# EAGLE design waterRunnerback (EAGLE 6.4)
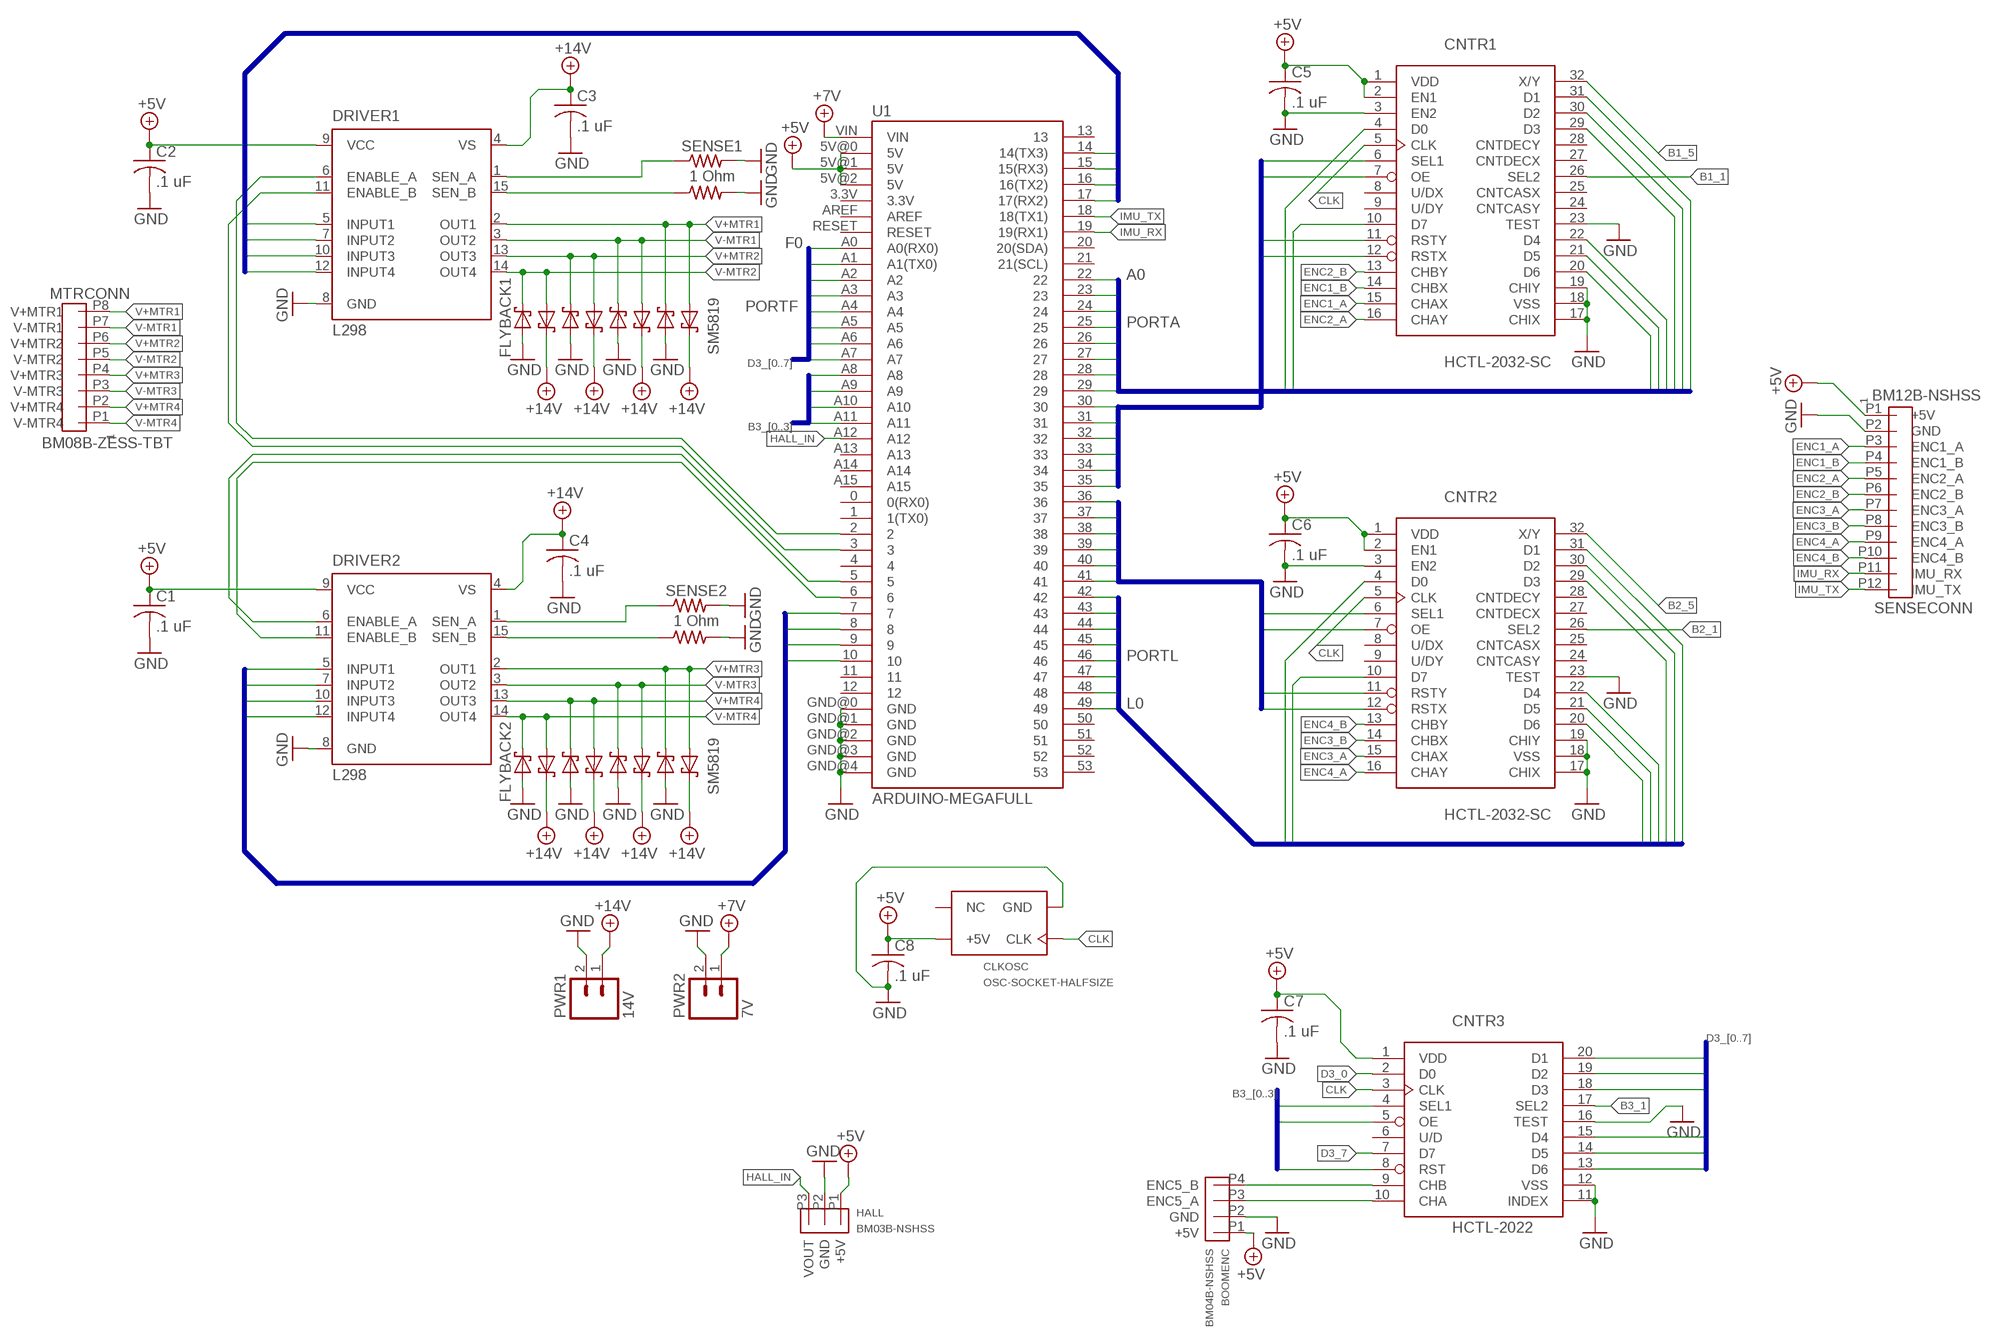
[diagram p0: schematic, sheet 1]

## Parts
BOOMENC  BM04B-NSHSS  [BM04B-NSHSS]
C1  .1 uF  C-USC1608  [C1608]
C2  .1 uF  C-USC1608  [C1608]
C3  .1 uF  C-USC1608  [C1608]
C4  .1 uF  C-USC1608  [C1608]
C5  .1 uF  C-USC1608  [C1608]
C6  .1 uF  C-USC1608  [C1608]
C7  .1 uF  C-USC1608  [C1608]
C8  .1 uF  C-USC1608  [C1608]
CLKOSC  OSC-SOCKET-HALFSIZE  [OSC-SOCKET-HALFSIZE]
CNTR1  HCTL-2032-SC  [SO32W]
CNTR2  HCTL-2032-SC  [SO32W]
CNTR3  HCTL-2022  [DIL20]
DRIVER1  L298  [MULTIWATT-15]
DRIVER2  L298  [MULTIWATT-15]
FLYBACK1  SM5819  SM5817  [SOD123FL]
FLYBACK2  SM5819  SM5817  [SOD123FL]
HALL  BM03B-NSHSS  [BM03B-NSHSS]
MTRCONN  BM08B-ZESS-TBT  [BM08B-ZESS-TBT]
PWR1  14V  M025MM  [SCREWTERMINAL-5MM-2]
PWR2  7V  M025MM  [SCREWTERMINAL-5MM-2]
R1  1 Ohm  RL1220  [RL1220]
R2  1 Ohm  RL1220  [RL1220]
SENSE1  1 Ohm  RL1220  [RL1220]
SENSE2  1 Ohm  RL1220  [RL1220]
SENSECONN  BM12B-NSHSS  [BM12B-NSHSS]
U1  ARDUINO-MEGAFULL  [ARDUINO_MEGA]
U$1  SM5817  [SOD123FL]
U$2  SM5817  [SOD123FL]
U$3  SM5819  SM5817  [SOD123FL]
U$4  SM5817  [SOD123FL]
U$5  SM5817  [SOD123FL]
U$6  SM5817  [SOD123FL]
U$7  SM5817  [SOD123FL]
U$8  SM5819  SM5817  [SOD123FL]
U$9  SM5817  [SOD123FL]
U$10  SM5817  [SOD123FL]
U$11  SM5817  [SOD123FL]
U$12  SM5817  [SOD123FL]
U$13  SM5817  [SOD123FL]
U$14  SM5819  SM5817  [SOD123FL]

## Nets
+5V: BOOMENC.P1(+5V) C1.1 C2.1 C5.1 C6.1 C7.1 C8.1 CLKOSC.P8(+5V) CNTR1.1(VDD) CNTR1.2(EN1) CNTR2.1(VDD) CNTR2.2(EN1) CNTR3.1(VDD) DRIVER1.9(VCC) DRIVER2.9(VCC) HALL.P1(+5V) SENSECONN.P1(+5V) U1.5V@0(5V) U1.5V@1(5V) U1.5V@2(5V)
+7V: PWR2.1 U1.VIN
+14V [PWR]: C3.1 C4.1 DRIVER1.4(VS) DRIVER2.4(VS) PWR1.1 U$1.C U$2.C U$4.C U$6.C U$8.C U$10.C U$12.C U$14.C
B1_0: CNTR1.6(SEL1) U1.30
B1_1: CNTR1.26(SEL2) U1.31
B1_2: CNTR1.7(OE) U1.32
B1_3: CNTR1.11(RSTY) U1.33
B1_4: CNTR1.12(RSTX) U1.34
B1_5: CNTR1.32(X/Y) U1.35
B2_0: CNTR2.6(SEL1) U1.36
B2_1: CNTR2.26(SEL2) U1.37
B2_2: CNTR2.7(OE) U1.38
B2_3: CNTR2.11(RSTY) U1.39
B2_4: CNTR2.12(RSTX) U1.40
B2_5: CNTR2.32(X/Y) U1.41
B3_0: CNTR3.4(SEL1) U1.A8
B3_1: CNTR3.17(SEL2) U1.A9
B3_2: CNTR3.5(OE) U1.A10
B3_3: CNTR3.8(RST) U1.A11
CLK: CLKOSC.P5(CLK) CNTR1.5(CLK) CNTR2.5(CLK) CNTR3.3(CLK)
D1_0: CNTR1.4(D0) U1.22
D1_1: CNTR1.31(D1) U1.23
D1_2: CNTR1.30(D2) U1.24
D1_3: CNTR1.29(D3) U1.25
D1_4: CNTR1.22(D4) U1.26
D1_5: CNTR1.21(D5) U1.27
D1_6: CNTR1.20(D6) U1.28
D1_7: CNTR1.10(D7) U1.29
D2_0: CNTR2.4(D0) U1.49
D2_1: CNTR2.31(D1) U1.48
D2_2: CNTR2.30(D2) U1.47
D2_3: CNTR2.29(D3) U1.46
D2_4: CNTR2.22(D4) U1.45
D2_5: CNTR2.21(D5) U1.44
D2_6: CNTR2.20(D6) U1.43
D2_7: CNTR2.10(D7) U1.42
D3_0: CNTR3.2(D0) U1.A0(A0(RX0))
D3_1: CNTR3.20(D1) U1.A1(A1(TX0))
D3_2: CNTR3.19(D2) U1.A2
D3_3: CNTR3.18(D3) U1.A3
D3_4: CNTR3.15(D4) U1.A4
D3_5: CNTR3.14(D5) U1.A5
D3_6: CNTR3.13(D6) U1.A6
D3_7: CNTR3.7(D7) U1.A7
ENC1_A: CNTR1.15(CHAX) SENSECONN.P3(ENC1_A)
ENC1_B: CNTR1.14(CHBX) SENSECONN.P4(ENC1_B)
ENC2_A: CNTR1.16(CHAY) SENSECONN.P5(ENC2_A)
ENC2_B: CNTR1.13(CHBY) SENSECONN.P6(ENC2_B)
ENC3_A: CNTR2.15(CHAX) SENSECONN.P7(ENC3_A)
ENC3_B: CNTR2.14(CHBX) SENSECONN.P8(ENC3_B)
ENC4_A: CNTR2.16(CHAY) SENSECONN.P9(ENC4_A)
ENC4_B: CNTR2.13(CHBY) SENSECONN.P10(ENC4_B)
ENC5_A: BOOMENC.P3(ENC5_A) CNTR3.10(CHA)
ENC5_B: BOOMENC.P4(ENC5_B) CNTR3.9(CHB)
GND: BOOMENC.P2(GND) C1.2 C2.2 C3.2 C4.2 C5.2 C6.2 C7.2 C8.2 CLKOSC.P4(GND) CNTR1.3(EN2) CNTR1.17(CHIX) CNTR1.18(VSS) CNTR1.19(CHIY) CNTR1.23(TEST) CNTR2.3(EN2) CNTR2.17(CHIX) CNTR2.18(VSS) CNTR2.19(CHIY) CNTR2.23(TEST) CNTR3.11(INDEX) CNTR3.12(VSS) CNTR3.16(TEST) DRIVER1.8(GND) DRIVER2.8(GND) FLYBACK1.A FLYBACK2.A HALL.P2(GND) PWR1.2 PWR2.2 R1.P$2 R2.P$2 SENSE1.P$2 SENSE2.P$2 SENSECONN.P2(GND) U1.GND@0(GND) U1.GND@1(GND) U1.GND@2(GND) U1.GND@3(GND) U1.GND@4(GND) U$3.A U$5.A U$7.A U$9.A U$11.A U$13.A
HALL_IN: HALL.P3(VOUT) U1.A12
IMU_RX: SENSECONN.P11(IMU_RX) U1.19(19(RX1))
IMU_TX: SENSECONN.P12(IMU_TX) U1.18(18(TX1))
IN1_1: DRIVER1.5(INPUT1) U1.14(14(TX3))
IN1_2: DRIVER1.7(INPUT2) U1.15(15(RX3))
IN1_3: DRIVER1.10(INPUT3) U1.16(16(TX2))
IN1_4: DRIVER1.12(INPUT4) U1.17(17(RX2))
IN2_1: DRIVER2.5(INPUT1) U1.7
IN2_2: DRIVER2.7(INPUT2) U1.8
IN2_3: DRIVER2.10(INPUT3) U1.9
IN2_4: DRIVER2.12(INPUT4) U1.10
PWM1: DRIVER1.6(ENABLE_A) U1.2
PWM2: DRIVER1.11(ENABLE_B) U1.3
PWM3: DRIVER2.6(ENABLE_A) U1.5
PWM4: DRIVER2.11(ENABLE_B) U1.6
SENSE1: DRIVER1.1(SEN_A) SENSE1.P$1
SENSE2: DRIVER1.15(SEN_B) R2.P$1
SENSE3: DRIVER2.1(SEN_A) SENSE2.P$1
SENSE4: DRIVER2.15(SEN_B) R1.P$1
V+MTR1 [PWR]: DRIVER1.2(OUT1) MTRCONN.P8(V+MTR1) U$13.C U$14.A
V+MTR2 [PWR]: DRIVER1.13(OUT3) MTRCONN.P6(V+MTR2) U$9.C U$10.A
V+MTR3 [PWR]: DRIVER2.2(OUT1) MTRCONN.P4(V+MTR3) U$7.C U$8.A
V+MTR4 [PWR]: DRIVER2.13(OUT3) MTRCONN.P2(V+MTR4) U$3.C U$4.A
V-MTR1 [PWR]: DRIVER1.3(OUT2) MTRCONN.P7(V-MTR1) U$11.C U$12.A
V-MTR2 [PWR]: DRIVER1.14(OUT4) FLYBACK1.C MTRCONN.P5(V-MTR2) U$1.A
V-MTR3 [PWR]: DRIVER2.3(OUT2) MTRCONN.P3(V-MTR3) U$5.C U$6.A
V-MTR4 [PWR]: DRIVER2.14(OUT4) FLYBACK2.C MTRCONN.P1(V-MTR4) U$2.A
Unconnected: CLKOSC.P1(NC) CNTR1.8(U/DX) CNTR1.9(U/DY) CNTR1.24(CNTCASY) CNTR1.25(CNTCASX) CNTR1.27(CNTDECX) CNTR1.28(CNTDECY) CNTR2.8(U/DX) CNTR2.9(U/DY) CNTR2.24(CNTCASY) CNTR2.25(CNTCASX) CNTR2.27(CNTDECX) CNTR2.28(CNTDECY) CNTR3.6(U/D) U1.0(0(RX0)) U1.1(1(TX0)) U1.3.3V U1.4 U1.11 U1.12 U1.13 U1.20(20(SDA)) U1.21(21(SCL)) U1.50 U1.51 U1.52 U1.53 U1.A13 U1.A14 U1.A15 U1.AREF U1.RESET

## Buses
IN1_[1..4]
IN2_[1..4]
D1_[0..7]
B1_[0..5]
D2_[0..7]
B2_[0..5]
D3_[0..7]
B3_[0..3]

## Notes on the sheet
- F0
- A0
- PORTF
- PORTA
- PORTL
- L0

## Library data of the parts
BOOMENC = mylbr:BM04B-NSHSS
C1-C8 = rcl:C-US: CAPACITOR, American symbol
CLKOSC = mylbr:OSC-SOCKET-HALFSIZE
CNTR1 CNTR2 = avago2:HCTL-2032-SC
CNTR3 = avago2:HCTL-2022
DRIVER1 DRIVER2 = st-microelectronics:L298: DUAL FULL-BRIDGE DRIVER; MPN: L298N; OC_FARNELL: 1589425; OC_NEWARK: 32M1527
FLYBACK1 FLYBACK2 U$1-U$14 = diode:SM5817
HALL = mylbr:BM03B-NSHSS
MTRCONN = mylbr:BM08B-ZESS-TBT
PWR1 PWR2 = SparkFun-Connectors:M02: Header 2 Standard 2-pin 0.1" header. Use with straight break away headers (SKU : PRT-00116), right angle break away headers (PRT-00553), swiss pins (PRT-00743), machine pins (PRT-00117), and female headers (PRT-00115). Molex polarized connector foot print use with SKU : PRT-08233 with associated crimp pins and housings.
R1 R2 SENSE1 SENSE2 = mylbr:RL1220
SENSECONN = mylbr:BM12B-NSHSS
U1 = SparkFun-Boards:ARDUINO-MEGA: Arduino Mega board footprint

## Net classes
0 default: width 0.254 mm, drill 0.508 mm, clearance 0.254 mm
1 PWR: width 0.305 mm, drill 0.508 mm, clearance 0.305 mm

## Board
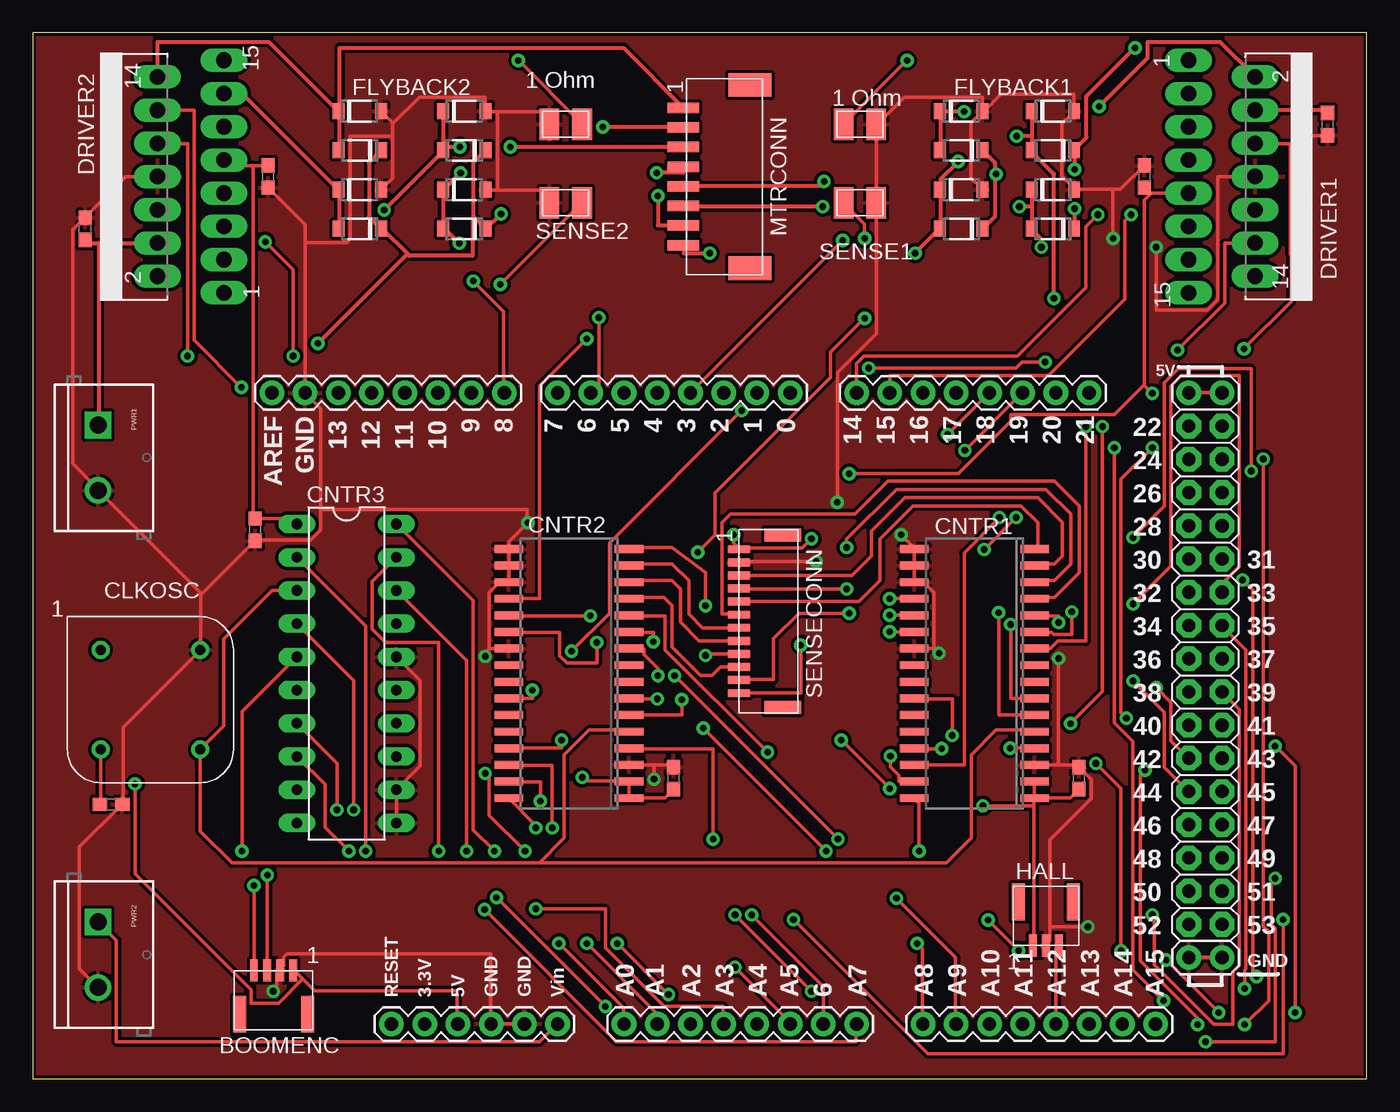
[diagram p1: board, top side]
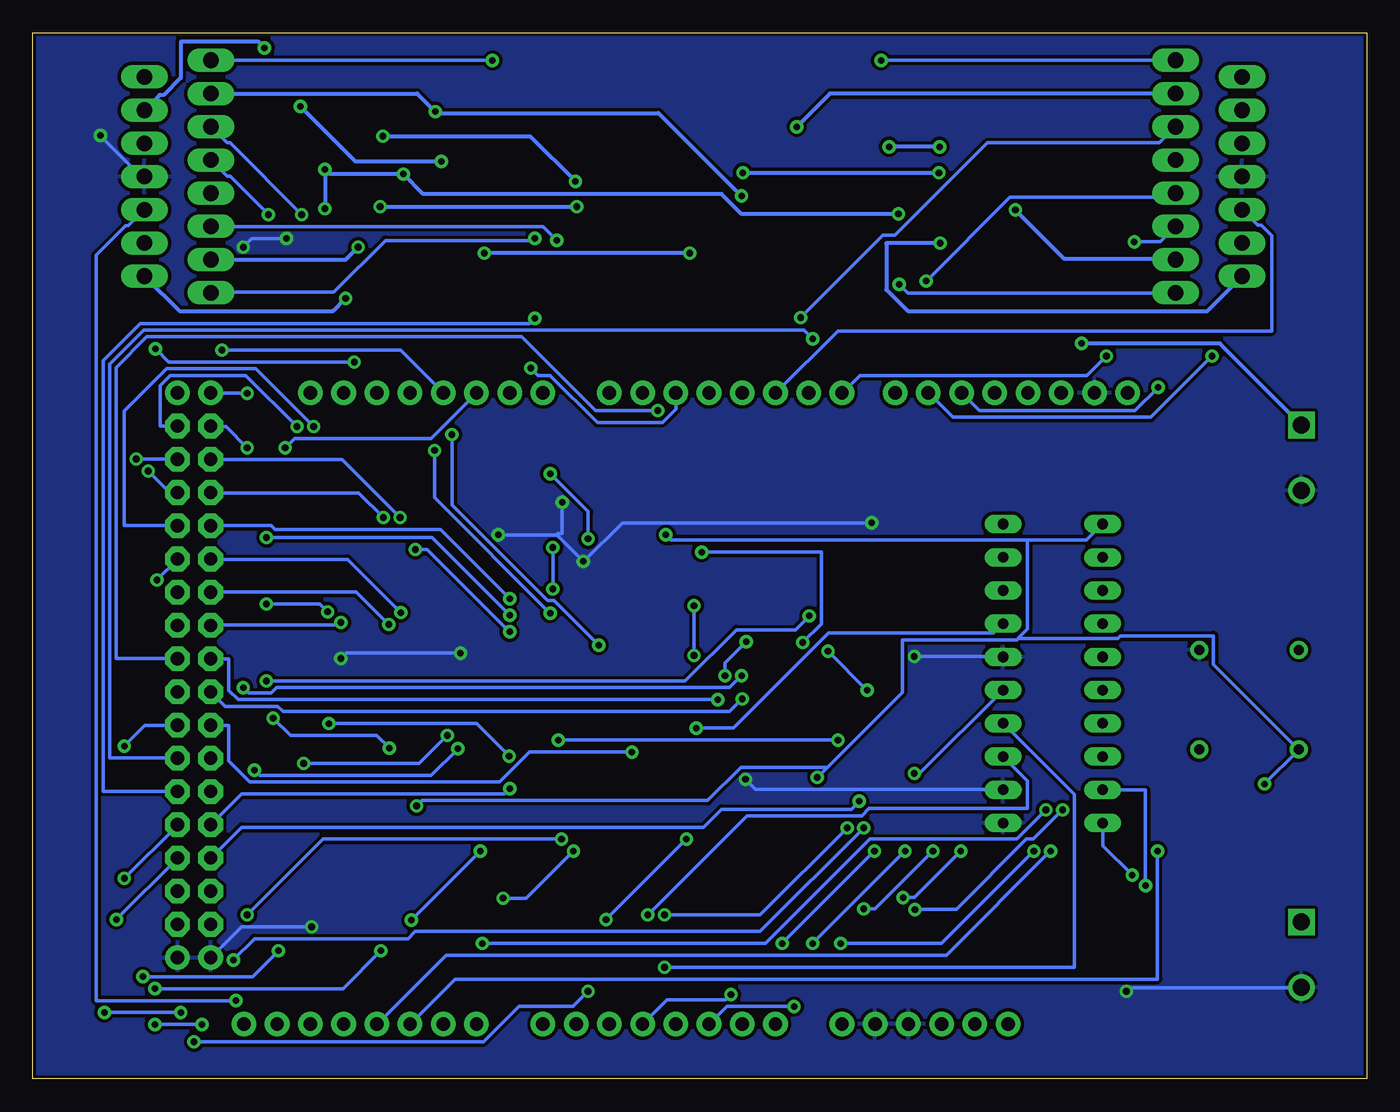
[diagram p2: board, bottom side, seen from below]

Size 102 x 80 mm. Coordinates in mm from the lower left corner, seen from the top.
Outline: 0,0 102,0 102,80 0,80 0,0
Copper layers (1*16): Top 0.035mm / dielectric 1.5mm / Bottom 0.035mm
Design rules "SparkFun": minimum track width 8mil, minimum drill 20mil, track to track 8mil, track to pad 8mil, pad to pad 8mil, via to via 8mil, smd to smd 8mil, copper to edge 10mil, drill to drill 8mil, minimum pad ring 12mil, minimum via ring 10mil, stop-mask expansion 4mil, vias tented up to drill 25mil, thermal gap 10mil

### Footprints (pad centres in the part's own frame; a part is rotated, then mirrored left to right if it is on the bottom)
BM04B-NSHSS = smd 0.6 x 1.7: P1 1.5,0.06; P2 0.5,0.06; P3 -0.5,0.06; P4 -1.5,0.06 | smd 1 x 2.8: S1 2.6,-3.29; S2 -2.6,-3.29
C1608 = smd 1.1 x 1: 1 -0.85,0; 2 0.85,0
OSC-SOCKET-HALFSIZE = drill 0.762: P1 -3.81,3.81; P4 3.81,3.81; P5 3.81,-3.81; P8 -3.81,-3.81
SO32W = smd 0.6 x 2.2: 1 -9.525,-4.6; 2 -8.255,-4.6; 3 -6.985,-4.6; 4 -5.715,-4.6; 5 -4.445,-4.6; 6 -3.175,-4.6; 7 -1.905,-4.6; 8 -0.635,-4.6; 9 0.635,-4.6; 10 1.905,-4.6; 11 3.175,-4.6; 12 4.445,-4.6; 13 5.715,-4.6; 14 6.985,-4.6; 15 8.255,-4.6; 16 9.525,-4.6; 17 9.525,4.6; 18 8.255,4.6; 19 6.985,4.6; 20 5.715,4.6; 21 4.445,4.6; 22 3.175,4.6; 23 1.905,4.6; 24 0.635,4.6; 25 -0.635,4.6; 26 -1.905,4.6; 27 -3.175,4.6; 28 -4.445,4.6; 29 -5.715,4.6; 30 -6.985,4.6; 31 -8.255,4.6; 32 -9.525,4.6
DIL20 = drill 0.813 long: 1 -11.43,-3.81; 2 -8.89,-3.81; 3 -6.35,-3.81; 4 -3.81,-3.81; 5 -1.27,-3.81; 6 1.27,-3.81; 7 3.81,-3.81; 8 6.35,-3.81; 9 8.89,-3.81; 10 11.43,-3.81; 11 11.43,3.81; 12 8.89,3.81; 13 6.35,3.81; 14 3.81,3.81; 15 1.27,3.81; 16 -1.27,3.81; 17 -3.81,3.81; 18 -6.35,3.81; 19 -8.89,3.81; 20 -11.43,3.81
MULTIWATT-15 = drill 1.2 long: 1 -8.89,-7.62; 2 -7.62,-2.54; 3 -6.35,-7.62; 4 -5.08,-2.54; 5 -3.81,-7.62; 6 -2.54,-2.54; 7 -1.27,-7.62; 8 0,-2.54; 9 1.27,-7.62; 10 2.54,-2.54; 11 3.81,-7.62; 12 5.08,-2.54; 13 6.35,-7.62; 14 7.62,-2.54; 15 8.89,-7.62
SOD123FL = smd 0.91 x 1.22: A 1.625,0; C -1.625,0
BM03B-NSHSS = smd 0.6 x 1.7: P1 1,1.87; P2 0,1.87; P3 -1,1.87 | smd 1 x 2.8: S1 2.1,-1.48; S2 -2.1,-1.48
BM08B-ZESS-TBT = smd 0.8 x 2.4: P1 5.25,1.25; P2 3.75,1.25; P3 2.25,1.25; P4 0.75,1.25; P5 -0.75,1.25; P6 -2.25,1.25; P7 -3.75,1.25; P8 -5.25,1.25 | smd 1.8 x 3.3: S1 7,-3.85; S2 -7,-3.85
SCREWTERMINAL-5MM-2 = drill 1.3 pad 2.032 square: 1 0,0 | drill 1.3 pad 2.032: 2 5,0
RL1220 = smd 1.5 x 2.4: P$1 0,0; P$2 2.5,0
BM12B-NSHSS = smd 0.6 x 1.7: P1 5.5,0; P2 4.5,0; P3 3.5,0; P4 2.5,0; P5 1.5,0; P6 0.5,0; P7 -0.5,0; P8 -1.5,0; P9 -2.5,0; P10 -3.5,0; P11 -4.5,0; P12 -5.5,0 | smd 1 x 2.8: S1 6.6,-3.35; S2 -6.6,-3.35
ARDUINO_MEGA = drill 1.016 pad 1.88: 0 63.5,50.8; 1 60.96,50.8; 2 58.42,50.8; 3 55.88,50.8; 3.3V 35.56,2.54; 4 53.34,50.8; 5 50.8,50.8; 5V@0 38.1,2.54; 5V@1 93.98,50.8; 5V@2 96.52,50.8; 6 48.26,50.8; 7 45.72,50.8; 8 41.656,50.8; 9 39.116,50.8; 10 36.576,50.8; 11 34.036,50.8; 12 31.496,50.8; 13 28.956,50.8; 14 68.58,50.8; 15 71.12,50.8; 16 73.66,50.8; 17 76.2,50.8; 18 78.74,50.8; 19 81.28,50.8; 20 83.82,50.8; 21 86.36,50.8; A0 50.8,2.54; A1 53.34,2.54; A2 55.88,2.54; A3 58.42,2.54; A4 60.96,2.54; A5 63.5,2.54; A6 66.04,2.54; A7 68.58,2.54; A8 73.66,2.54; A9 76.2,2.54; A10 78.74,2.54; A11 81.28,2.54; A12 83.82,2.54; A13 86.36,2.54; A14 88.9,2.54; A15 91.44,2.54; AREF 23.876,50.8; GND@0 40.64,2.54; GND@1 43.18,2.54; GND@2 93.98,7.62; GND@3 96.52,7.62; GND@4 26.416,50.8; RESET 33.02,2.54; VIN 45.72,2.54 | drill 1.016 pad 1.88 octagon: 22 93.98,48.26; 23 96.52,48.26; 24 93.98,45.72; 25 96.52,45.72; 26 93.98,43.18; 27 96.52,43.18; 28 93.98,40.64; 29 96.52,40.64; 30 93.98,38.1; 31 96.52,38.1; 32 93.98,35.56; 33 96.52,35.56; 34 93.98,33.02; 35 96.52,33.02; 36 93.98,30.48; 37 96.52,30.48; 38 93.98,27.94; 39 96.52,27.94; 40 93.98,25.4; 41 96.52,25.4; 42 93.98,22.86; 43 96.52,22.86; 44 93.98,20.32; 45 96.52,20.32; 46 93.98,17.78; 47 96.52,17.78; 48 93.98,15.24; 49 96.52,15.24; 50 93.98,12.7; 51 96.52,12.7; 52 93.98,10.16; 53 96.52,10.16

### Placement (x,y rotation side)
BOOMENC  18.41,8.26 0 top
C1  85,69 90 top
C2  18,69 270 top
C3  4,65 90 top
C4  99,73 270 top
C5  80,23 90 top
C6  49,23 90 top
C7  17,42 270 top
C8  6,21 0 top
CLKOSC  9,29 0 top
CNTR1  72,31 90 top
CNTR2  41,31 90 top
CNTR3  24,31 270 top
DRIVER1  96,69 270 top
DRIVER2  7,69 90 top
FLYBACK1  78,74 0 top
FLYBACK2  25,74 0 top
HALL  77.47,12.06 180 top
MTRCONN  51,69 90 top
PWR1  5,50 270 top
PWR2  5,12 270 top
R1  42,73 180 top
R2  62,67 0 top
SENSE1  62,73 0 top
SENSE2  42,67 180 top
SENSECONN  54,35 90 top
U1  -5.59,1.66 0 top
U$1  78,71 180 top
U$2  25,71 180 top
U$3  25,68 0 top
U$4  25,65 180 top
U$5  33,74 0 top
U$6  33,71 180 top
U$7  33,68 0 top
U$8  33,65 180 top
U$9  78,68 0 top
U$10  78,65 180 top
U$11  71,74 0 top
U$12  71,71 180 top
U$13  71,68 0 top
U$14  71,65 180 top

### Tracks (layer width: path | path; a pad name or v marks a point on that pad's centre or on a via)
+5V  (via drill 0.51)
  Top 0.254: C5.1 79.33,21.48 CNTR1.1 | CNTR1.1 CNTR1.2 | C6.1 48.33,21.48 CNTR2.1 CNTR2.2 45.52,22.81 42.01,22.81 v42.01,23.06 | C8.1 5.19,21.04 CLKOSC.P8 | CNTR3.1 19.77,42.85 C7.1 16.97,42.98 16.87,43.08 16.87,69.85 | DRIVER2.9 15.04,69.85 16.87,69.85 | 16.87,69.85 C2.1 | DRIVER1.9 85.42,67.73 C1.1 85.39,67.61 84.99,67.21 84.99,53.03 | U1.5V@1 88.39,52.48 90.88,52.48 U1.5V@2 | v85.6,52.43 84.99,53.03 | BOOMENC.P1 20.02,8.28 20.65,7.64 | 20.65,7.64 21.54,6.76 32.46,6.76 32.46,4.22 U1.5V@0 | 76.5,10.21 HALL.P1 76.56,10.31 76.56,20.88 | 76.56,20.88 76.56,21.39 CNTR1.1 | 54,40.54 SENSECONN.P1 | v53.59,41.6 53.59,41 53.95,40.64 SENSECONN.P1 | v72.64,20.88 76.56,20.88 | 20.65,7.64 18.8,5.79 16.71,5.79 16.71,6.81 7.82,15.7 v7.82,22.55 | v62.43,46.28 70.76,46.28 74.78,50.29 74.78,50.8 82.7,50.8 84.89,52.98 84.99,53.03 | v59.54,41.3 58.83,40.59 54.1,40.59 SENSECONN.P1
  Bottom 0.254: v85.6,52.43 88.34,52.43 U1.5V@1 | v53.59,41.6 53.19,41.2 25.96,41.2 | 25.96,41.2 21.44,41.2 20.22,42.42 CNTR3.1 | 41.33,23.75 35.51,29.57 35.51,33.58 26.77,33.58 26.59,33.76 | 41.33,23.75 v42.01,23.06 | 26.59,33.76 25.96,34.39 25.96,41.2 | 26.59,33.76 26.52,33.68 19.05,33.68 18.85,33.88 11.73,33.88 11.73,31.7 5.23,25.2 CLKOSC.P8 5.28,25.09 v7.82,22.55 | v72.64,20.88 72.24,21.29 50.39,21.29 47.85,23.82 41.4,23.82 41.33,23.75 | v62.43,46.28 59.54,43.38 v59.54,41.3
+7V
  Top 0.254: U1.VIN 40.08,4.17 38.76,2.85 6.4,2.85 6.4,10.62 5.03,11.99 PWR2.1
+14V  (via drill 0.51)
  Top 0.305: C4.1 98.77,74.08 DRIVER1.4 | C3.1 4.23,63.92 5.03,63.92 | 5.03,63.92 DRIVER2.4 | v79.65,66.55 79.65,65.02 U$10.C | v79.65,69.55 79.65,70.97 U$1.C 79.7,71.12 80.57,71.98 80.57,75.13 v84.28,78.84 | 73.56,69.19 73.56,70.05 72.64,70.97 U$12.C | 73.56,69.19 73.56,65.94 72.64,65.02 U$14.C | v73.66,69.19 73.56,69.19 | U$2.C 26.62,70.97 25.7,70.05 25.7,65.94 26.62,65.02 U$4.C 26.77,64.97 28.65,63.09 | 33.73,65.89 33.68,65.94 33.68,70.05 34.59,70.97 U$6.C | 33.73,65.89 34.59,65.02 U$8.C 34.75,65.08 v35.81,66.14 | 28.65,63.09 28.8,62.94 33.63,62.94 33.63,65.79 33.73,65.89 | 5.03,63.92 5.03,50.04 PWR1.1 | v21.79,56.24 28.65,63.09
  Bottom 0.305: v79.65,66.55 v79.65,69.55 79.55,69.19 v73.66,69.19 72.14,67.67 49.33,67.67 47.8,66.14 v35.81,66.14 | v84.28,78.84 84.73,79.3 90.68,79.3 90.68,76.56 92,75.23 92.3,75.23 93.42,74.12 DRIVER1.4 | v21.79,56.24 11.23,56.24 5.03,50.04 PWR1.1
B1_0  (via drill 0.51)
  Top 0.254: v73.86,35.66 73.86,27.84 76.56,27.84 CNTR1.6
  Bottom 0.254: v73.86,35.66 77.93,39.73 88.34,39.73 U1.30
B1_1  (via drill 0.51)
  Top 0.254: v70.31,26.26 70.31,29.06 67.41,29.06 CNTR1.26 | v81.28,24.13 83.21,22.2 v83.21,9.8 | v93.57,7.82 93.27,8.13 93.27,37.39 v92.51,38.15
  Bottom 0.254: v70.31,26.26 72.44,24.13 v81.28,24.13 | v83.21,9.8 85.19,7.82 v93.57,7.82 | v92.51,38.15 90.93,39.73 U1.31
B1_2  (via drill 0.51)
  Top 0.254: v74.78,34.75 74.78,29.11 76.56,29.11 CNTR1.7
  Bottom 0.254: v74.78,34.75 77.27,37.24 88.34,37.24 U1.32
B1_3  (via drill 0.51)
  Top 0.254: v79.45,35.71 79.45,33.98 78.08,33.98 77.93,34.14 76.61,34.14 CNTR1.11 | v84.12,36.32 87.02,39.22 87.02,52.98 87.83,53.8 92.25,53.8 92.25,39.17 90.93,37.85 90.93,37.24 U1.33
  Bottom 0.254: v79.45,35.71 80.06,36.32 v84.12,36.32
B1_4  (via drill 0.51)
  Top 0.254: v78.44,34.9 78.44,35.41 76.61,35.41 CNTR1.12
  Bottom 0.254: v78.44,34.9 78.64,34.7 88.34,34.7 U1.34
B1_5  (via drill 0.51)
  Top 0.254: v67.77,17.42 67.77,21.08 67.41,21.44 CNTR1.32 | v75.39,9.8 v73.05,12.14 | v92.66,6.91 92.66,8.33 92.76,8.43 92.76,32.82 90.93,34.65 U1.35
  Bottom 0.254: v73.05,12.14 v67.77,17.42 | v75.39,9.8 78.28,6.91 v92.66,6.91
B2_0  (via drill 0.51)
  Top 0.254: v49.63,29.01 49.63,27.84 45.62,27.84 CNTR2.6
  Bottom 0.254: v49.63,29.01 86.31,29.01 87.02,29.72 87.02,32.11 88.34,32.11 U1.36
B2_1  (via drill 0.51)
  Top 0.254: v38.2,29.72 38.2,29.11 36.42,29.11 CNTR2.26 | v41.2,32.72 44.09,35.61 44.09,41 v54.2,51.1
  Bottom 0.254: v41.2,32.72 v38.2,29.72 | v54.2,51.1 58.98,51.1 64.62,56.74 93.27,56.74 95.61,54.41 95.61,32.16 90.93,32.16 U1.37
B2_2  (via drill 0.51)
  Top 0.254: v47.75,29.06 45.62,29.06 CNTR2.7
  Bottom 0.254: v47.75,29.06 48.72,28.09 82.86,28.09 83.26,28.5 87.27,28.5 88.34,29.57 U1.38
B2_3  (via drill 0.51)
  Top 0.254: v47.45,33.43 47.45,34.14 45.62,34.14 CNTR2.11 | v61.57,18.34 v49.07,30.84 | v85.6,12.55 85.75,12.39 85.75,8.74 90.32,4.17 91.75,4.17 91.75,8.18 92.25,8.69 92.25,28.25 90.93,29.57 U1.39
  Bottom 0.254: v47.45,33.43 49.07,31.8 v49.07,30.84 | v61.57,18.34 79.81,18.34 v85.6,12.55
B2_4  (via drill 0.51)
  Top 0.254: v56.19,24.99 48.36,32.82 48.36,35.41 45.62,35.41 CNTR2.12
  Bottom 0.254: v56.19,24.99 64.01,24.99 66.29,22.71 85.39,22.71 87.02,24.33 87.02,27.03 88.34,27.03 U1.40
B2_5  (via drill 0.51)
  Top 0.254: v38.46,19.2 38.46,19.41 36.42,21.44 CNTR2.32 | v90.68,5.08 v86.67,9.09 | v96.52,5.08 96.52,23.93 v95,25.45
  Bottom 0.254: v38.46,19.2 46.38,11.28 72.75,11.28 73.3,10.72 85.04,10.72 v86.67,9.09 | v96.52,5.08 v90.68,5.08 | v95,25.45 93.42,27.03 90.93,27.03 U1.41
B3_0  (via drill 0.51)
  Top 0.254: v24.54,20.57 24.54,30.48 20.22,34.8 CNTR3.4 | v67.61,10.36 68.02,9.96 68.02,4.22 U1.A8
  Bottom 0.254: v24.54,20.57 26.77,18.34 38,18.34 45.97,10.36 v67.61,10.36
B3_1  (via drill 0.51)
  Top 0.254: v60.66,17.42 v51.26,26.82 | v66.04,13.82 70.56,9.3 70.56,4.22 U1.A9
  Bottom 0.254: v51.26,26.82 48.41,26.82 41.15,34.09 28.55,34.09 27.84,34.8 CNTR3.17 | v60.66,17.42 64.26,13.82 v66.04,13.82
B3_2  (via drill 0.51)
  Top 0.254: v16,17.42 16,28.09 20.17,32.26 CNTR3.5
  Bottom 0.254: v16,17.42 16,7.62 69.7,7.62 73.1,4.22 U1.A10
B3_3  (via drill 0.51)
  Top 0.254: v24.18,17.42 22.35,19.25 22.35,22.5 20.22,24.64 CNTR3.8
  Bottom 0.254: v24.18,17.42 32.16,9.45 70.41,9.45 75.64,4.22 U1.A11
CLK
  Top 0.254: CNTR3.3 18.3,37.35 14.61,33.66 14.61,26.98 CLKOSC.P5 12.81,18.94 15.24,16.51 38.73,16.51 | CNTR2.5 45.48,26.67 42.55,26.67 40.64,24.77 40.64,18.41 38.73,16.51 | CNTR1.5 76.48,26.67 73.66,26.67 71.75,24.77 71.75,18.41 69.85,16.51 38.73,16.51
D1_0  (via drill 0.51)
  Top 0.254: v74.73,25.3 76.56,25.3 CNTR1.4 | v83.62,27.58 83.21,27.99 83.21,45.87 v85.6,48.26
  Bottom 0.254: v74.73,25.3 75.69,26.26 82.3,26.26 v83.62,27.58 | v85.6,48.26 87.22,49.89 88.34,49.89 U1.22
D1_1  (via drill 0.51)
  Top 0.254: v65.58,24.69 65.58,23.88 66.24,23.22 66.24,22.76 67.36,22.76 CNTR1.31 | v79.35,27.18 81.79,29.62 v81.79,49.89
  Bottom 0.254: v65.58,24.69 68.07,27.18 v79.35,27.18 | v81.79,49.89 85.7,53.8 91.49,53.8 92.25,53.03 92.25,49.94 90.93,49.94 U1.23
D1_2  (via drill 0.51)
  Top 0.254: v73.91,42.93 71.22,40.23 71.22,24.03 67.41,24.03 CNTR1.30
  Bottom 0.254: v73.91,42.93 78.33,47.35 88.34,47.35 U1.24
D1_3  (via drill 0.51)
  Top 0.254: v69.49,25.25 67.41,25.25 CNTR1.29 | v85.04,23.62 84.68,23.27 84.68,9.04 89.05,4.67 v89.05,4.17 | v92.66,4.17 94.49,5.99 94.49,11.28 94.08,11.68 v94.08,47.4
  Bottom 0.254: v69.49,25.25 71.53,23.22 84.63,23.22 v85.04,23.62 | v92.66,4.17 v89.05,4.17 | v94.08,47.4 90.93,47.4 U1.25
D1_4  (via drill 0.51)
  Top 0.254: v65.53,34.19 67.36,34.19 CNTR1.22 | v75.18,42.93 v72.75,40.49
  Bottom 0.254: v65.53,34.19 71.83,40.49 v72.75,40.49 | v75.18,42.93 77.06,44.81 88.34,44.81 U1.26
D1_5  (via drill 0.51)
  Top 0.254: v65.53,35.46 67.36,35.46 CNTR1.21 | v84.12,41.4 86.51,43.79 86.51,53.24 87.58,54.3 93.17,54.3 v93.17,46.48
  Bottom 0.254: v65.53,35.46 71.48,41.4 v84.12,41.4 | v93.17,46.48 91.54,44.86 90.93,44.86 U1.27
D1_6  (via drill 0.51)
  Top 0.254: v65.53,36.73 67.36,36.73 CNTR1.20
  Bottom 0.254: v65.53,36.73 70.81,42.01 83.46,42.01 83.77,42.32 88.34,42.32 U1.28
D1_7  (via drill 0.51)
  Top 0.254: v80.52,49.89 80.52,33.48 78.38,33.48 77.83,32.92 CNTR1.10
  Bottom 0.254: v80.52,49.89 84.94,54.3 91.75,54.3 95,51.05 95,42.32 90.93,42.32 U1.29
D2_0  (via drill 0.51)
  Top 0.254: v52.02,18.34 52.02,25.25 45.62,25.25 CNTR2.4 | v58.17,12.19 68.43,1.93 95.61,1.93 v95.61,12.19
  Bottom 0.254: v58.17,12.19 v52.02,18.34 | v95.61,12.19 90.93,16.87 U1.49
D2_1  (via drill 0.51)
  Top 0.254: v38.81,21.23 38.81,22.71 36.42,22.71 CNTR2.31
  Bottom 0.254: v38.81,21.23 39.42,20.62 49.33,20.62 50.7,19.25 86,19.25 88.34,16.92 U1.48
D2_2  (via drill 0.51)
  Top 0.254: v39.73,19.2 39.73,23.98 36.42,23.98 CNTR2.30 | v59.54,6.71 v53.7,12.55 | v89.66,2.85 95,2.85 95,11.53 94.69,11.84 94.69,15.04 v95,15.34
  Bottom 0.254: v39.73,19.2 46.38,12.55 v53.7,12.55 | v59.54,6.71 60.71,5.54 64.82,5.54 67.51,2.85 v89.66,2.85 | v95,15.34 90.93,19.41 U1.47
D2_3  (via drill 0.51)
  Top 0.254: v40.44,25.91 40.44,25.3 36.42,25.3 CNTR2.29 | v65.53,22.2 v61.82,25.91
  Bottom 0.254: v61.82,25.91 v40.44,25.91 | v65.53,22.2 65.94,21.79 86,21.79 88.34,19.46 U1.46
D2_4  (via drill 0.51)
  Top 0.254: v43.13,33.38 43.13,31.8 40.84,31.8 40.28,32.36 40.28,34.14 36.42,34.14 CNTR2.22 | v50.85,40.28 52.17,41.6 52.17,44.81 61.01,53.65 61.01,55.58 v63.6,58.17
  Bottom 0.254: v43.13,33.38 41.71,34.8 41.71,40.28 v50.85,40.28 | v63.6,58.17 64.01,57.76 93.78,57.76 96.62,54.91 96.62,22 90.93,22 U1.45
D2_5  (via drill 0.51)
  Top 0.254: v42.62,35.41 36.42,35.41 CNTR2.21 | v84.12,30.43 86.51,28.04 86.51,23.82 88.34,22 U1.44
  Bottom 0.254: v42.62,35.41 43.69,34.34 48.21,34.34 52.12,30.43 v84.12,30.43
D2_6  (via drill 0.51)
  Top 0.254: v42.37,56.59 38.76,52.98 38.76,36.73 36.42,36.73 CNTR2.20
  Bottom 0.254: v42.37,56.59 43.03,57.25 93.52,57.25 96.11,54.66 96.11,24.54 90.93,24.54 U1.43
D2_7  (via drill 0.51)
  Top 0.254: v47.8,30.84 47.8,31.39 46.74,32.46 46.74,32.87 45.62,32.87 CNTR2.10 | v85.9,29.92 87.02,28.8 87.02,25.86 88.34,24.54 U1.42
  Bottom 0.254: v47.8,30.84 48.72,29.92 83.36,29.92 83.77,29.52 85.5,29.52 v85.9,29.92
D3_0  (via drill 0.51)
  Top 0.254: v25.45,17.42 25.45,34.65 20.22,39.88 CNTR3.2 | v40.23,10.36 45.16,5.44 45.16,4.22 U1.A0
  Bottom 0.254: v25.45,17.42 32.51,10.36 v40.23,10.36
D3_1  (via drill 0.51)
  Top 0.254: v35.31,17.42 33.68,19.05 33.68,36.58 27.84,42.42 CNTR3.20 | v42.37,10.36 47.7,5.03 47.7,4.22 U1.A1
  Bottom 0.254: v42.37,10.36 v35.31,17.42
D3_2  (via drill 0.51)
  Top 0.254: v31.04,17.42 31.04,33.38 26.98,33.38 25.96,34.39 25.96,38.05 27.79,39.88 CNTR3.19 | v43.79,5.54 v35.46,13.87
  Bottom 0.254: v31.04,17.42 34.59,13.87 v35.46,13.87 | v43.79,5.54 48.92,5.54 50.24,4.22 U1.A2
D3_3  (via drill 0.51)
  Top 0.254: v33.17,17.42 33.17,32 27.84,37.34 CNTR3.18 | v38.46,13.01 43.79,13.01 43.79,10.01 48.26,5.54 52.78,5.54 52.78,4.22 U1.A3
  Bottom 0.254: v33.17,17.42 37.59,13.01 v38.46,13.01
D3_4  (via drill 0.51)
  Top 0.254: v34.59,23.37 34.9,23.06 34.9,20.17 v37.64,17.42 | v48.62,6.45 v44.7,10.36
  Bottom 0.254: v34.59,23.37 34.19,23.37 27.84,29.72 CNTR3.15 | v44.7,10.36 v37.64,17.42 | v48.62,6.45 49.02,6.04 53.49,6.04 55.32,4.22 U1.A4
D3_5  (via drill 0.51)
  Top 0.254: v53.7,8.53 57.86,4.37 57.86,4.22 U1.A5
  Bottom 0.254: v53.7,8.53 22.35,8.53 22.35,21.74 27.79,27.18 CNTR3.14
D3_6  (via drill 0.51)
  Top 0.254: v54.97,12.55 60.45,7.06 60.45,4.22 U1.A6
  Bottom 0.254: v54.97,12.55 47.4,20.12 38.61,20.12 38.05,20.68 25.96,20.68 25.96,22.81 27.79,24.64 CNTR3.13
D3_7  (via drill 0.51)
  Top 0.254: v23.27,20.57 23.27,24.13 20.22,27.18 CNTR3.7 | v34.54,12.95 44.65,2.85 62.94,2.85 62.94,4.17 U1.A7
  Bottom 0.254: v23.27,20.57 25.5,18.34 26.01,18.34 31.39,12.95 v34.54,12.95
ENC1_A
  Top 0.254: CNTR1.15 76.72,39.37 78.11,39.37 78.74,40.01 78.74,42.55 76.83,44.45 66.67,44.45 64.14,41.91 64.14,40.01 62.63,38.5 SENSECONN.P3
ENC1_B  (via drill 0.51)
  Top 0.254: CNTR1.14 76.72,38.1 78.11,38.1 79.38,39.37 79.38,43.18 77.47,45.09 66.04,45.09 62.23,41.27 v62.23,40.64 | SENSECONN.P4 54.03,37.47 v62.23,37.47
  Bottom 0.254: v62.23,40.64 v62.23,37.47
ENC2_A
  Top 0.254: CNTR1.16 76.83,40.76 76.83,42.55 75.56,43.81 67.31,43.81 64.77,41.27 64.77,38.1 63.17,36.5 SENSECONN.P5
ENC2_B
  Top 0.254: CNTR1.13 76.72,36.83 78.11,36.83 80.01,38.73 80.01,43.81 78.11,45.72 65.41,45.72 62.87,43.18 53.34,43.18 52.7,42.55 52.7,35.56 53.34,35.56 53.4,35.5 SENSECONN.P6
ENC3_A
  Top 0.254: CNTR2.15 45.72,39.37 48.9,39.37 50.16,38.1 50.16,35.56 51.23,34.5 SENSECONN.P7
ENC3_B
  Top 0.254: CNTR2.14 45.72,38.1 48.9,38.1 49.53,37.47 49.53,34.92 50.95,33.5 SENSECONN.P8
ENC4_A  (via drill 0.51)
  Top 0.254: CNTR2.16 45.72,40.64 48.9,40.64 51.44,38.73 v51.44,36.2 | v51.44,32.38 51.55,32.5 SENSECONN.P9
  Bottom 0.254: v51.44,36.2 v51.44,32.38
ENC4_B
  Top 0.254: CNTR2.13 45.72,36.83 48.26,36.83 48.9,36.2 48.9,33.02 51.05,30.86 51.95,30.86 52.58,31.5 SENSECONN.P10
ENC5_A  (via drill 0.51)
  Top 0.254: v17.93,15.6 17.93,8.33 BOOMENC.P3
  Bottom 0.254: v17.93,15.6 20.17,17.83 20.17,19.56 CNTR3.10
ENC5_B  (via drill 0.51)
  Top 0.254: v16.92,14.78 BOOMENC.P4
  Bottom 0.254: v16.92,14.78 16.92,22.1 20.17,22.1 CNTR3.9
GND  (via drill 0.51)
  Top 0.254: 78.44,24.02 79.83,24.02 C5.2 80.06,23.77 80.92,22.91 80.92,21.44 77.78,18.29 77.78,11.63 | 78.44,24.02 CNTR1.3 | C6.2 48.84,24.02 47.5,24.02 | 47.5,24.02 CNTR2.3 | 35.56,67.97 39.47,67.97 39.47,67 SENSE2.P$2 | 35.56,67.97 34.65,67.97 U$7.A | 27.53,73.1 27.53,72.08 | 27.53,72.08 27.53,68.89 26.67,68.02 U$3.A | 27.53,73.1 26.67,73.97 FLYBACK2.A | 35.56,73.97 39.47,73.97 39.47,73.05 R1.P$2 | 35.56,73.97 34.65,73.97 U$5.A 34.59,74.12 34.59,75.08 29.57,75.08 27.64,73.15 27.53,73.1 | 35.56,73.97 35.56,67.97 | 20.83,63.96 20.83,52.48 U1.GND@4 20.88,52.38 22,51.26 22,43.54 | 20.83,63.96 20.83,65.33 18.03,68.12 C2.2 | 27.53,72.08 24.28,72.08 24.28,64.21 24.03,63.96 20.83,63.96 | 18.95,8.33 BOOMENC.P2 | BOOMENC.P2 19,8.43 19.2,8.64 19.2,9.3 19.46,9.55 35,9.55 35,4.22 U1.GND@0 35.15,4.22 37.54,4.22 U1.GND@1 | 9.55,69.04 DRIVER2.8 9.5,68.99 7.11,68.99 4.01,65.89 C3.2 3.91,65.79 3.05,64.92 3.05,47.04 4.98,45.11 PWR1.2 5.03,44.96 12.8,37.19 12.8,37.13 12.88,37.06 | 12.88,37.06 12.85,37.03 12.85,32.92 CLKOSC.P4 12.8,32.77 6.91,26.87 6.91,21.08 6.86,21.03 C8.2 6.76,20.93 3.56,17.73 3.56,8.43 4.98,7.01 PWR2.2 | 12.88,37.06 16.97,41.15 C7.2 17.12,41.2 21.23,41.2 22,41.96 22,43.54 | v18.39,6.71 18.64,6.96 18.64,8.03 18.85,8.23 BOOMENC.P2 | v96.83,72.14 98.96,72.14 C4.2 | U$13.A 72.59,68.02 71.73,68.89 71.73,73.1 72.59,73.97 U$11.A | 82.6,68.02 79.65,68.02 U$9.A 79.6,68.12 78.69,69.04 78.69,73.05 79.6,73.97 FLYBACK1.A 79.6,74.12 79.6,75.29 74.02,75.29 72.75,74.02 U$11.A | 82.6,68.02 83.16,68.02 84.99,69.85 C1.2 | U$11.A 72.59,74.12 72.59,75.08 66.65,75.08 64.62,73.05 SENSE1.P$2 64.52,73 64.52,67 R2.P$2 64.52,66.9 64.52,57 61.52,54 v61.52,44.09
  Top 0.254: v85.9,63.6 85.9,58.78 89.81,58.78 90.63,59.59 90.63,68.99 93.42,68.99 DRIVER1.8 | 82.6,68.02 v82.6,64.26 | U1.GND@2 88.39,9.3 90.88,9.3 U1.GND@3 | 77.47,10.21 HALL.P2 77.52,10.31 77.78,10.57 77.78,11.63 | 77.78,11.63 v80.67,11.63 | 68.89,32.92 67.41,32.92 CNTR1.23 | 68.89,32.92 68.89,37.19 68.12,37.95 67.41,37.95 CNTR1.19 67.41,38.1 67.41,39.22 CNTR1.18 67.41,39.37 67.41,40.44 CNTR1.17 67.36,40.54 67.36,40.64 v66.4,41.6 | 54,39.52 SENSECONN.P2 54.1,39.57 v59.89,39.57 | 34.9,32.92 36.37,32.92 CNTR2.23 | 34.9,32.92 34.9,37.19 35.66,37.95 36.37,37.95 CNTR2.19 36.42,38.1 36.42,39.22 CNTR2.18 36.42,39.37 36.42,40.49 CNTR2.17 36.42,40.64 36.42,41.1 v37.85,42.52 37.8,42.62 37.8,43.54 22,43.54 | CNTR3.11 27.84,19.61 27.84,22.1 CNTR3.12 27.89,22.2 29.62,23.93 29.62,30.48 27.84,32.26 CNTR3.16 | v47.5,22.91 47.5,24.02 | v34.59,32.31 34.59,32.56 34.85,32.82 34.9,32.92 | v78.44,32.16 78.44,24.02 | v69.29,32.56 68.99,32.87 68.89,32.92
  Bottom 0.254: v18.39,6.71 18.14,6.96 5.03,6.96 PWR2.2 | v96.83,72.14 93.73,69.04 93.47,69.04 DRIVER1.8 | v85.9,63.6 85.24,64.26 v82.6,64.26 | v80.67,11.63 86,11.63 88.34,9.3 U1.GND@2 | 61.92,41.6 v59.89,39.57 59.79,39.62 56.9,42.52 v37.85,42.52 | v66.4,41.6 61.92,41.6 | v47.5,22.91 46.74,22.15 27.84,22.15 CNTR3.12 | v34.59,32.31 27.84,32.31 CNTR3.16 | v78.44,32.16 78.03,32.56 v69.29,32.56 | v61.52,44.09 61.52,41.71 61.87,41.71 61.92,41.6
  pour Bottom: -1.27,-1.27 -1.27,81.28 103.5,81.28 103.5,-1.27
  pour Top: -0.64,-0.64 -0.64,80.64 102.87,80.64 102.87,-0.64
HALL_IN
  Top 0.254: HALL.P3 78.23,9.96 U1.A12
IMU_RX  (via drill 0.51)
  Top 0.254: v62.43,35.61 58.57,35.61 56.64,33.68 56.64,30.53 54,30.53 SENSECONN.P11 | v71.27,48.06 75.64,52.43 U1.19
  Bottom 0.254: v62.43,35.61 71.27,44.45 v71.27,48.06
IMU_TX  (via drill 0.51)
  Top 0.254: v58.73,33.17 58.73,29.52 54,29.52 SENSECONN.P12 | v69.95,49.28 73.1,52.43 U1.18
  Bottom 0.254: v58.73,33.17 62.13,36.58 62.64,36.58 69.95,43.89 v69.95,49.28
IN1_1  (via drill 0.51)
  Top 0.254: v81.43,66.09 80.52,65.18 80.52,60.5 75.29,55.27 63.55,55.27 62.99,54.71 62.99,52.48 U1.14
  Bottom 0.254: v81.43,66.09 86.92,71.58 87.12,71.58 88.34,72.8 DRIVER1.5
IN1_2  (via drill 0.51)
  Top 0.254: v83.97,66.09 83.52,65.63 83.52,59.64 77.67,53.8 65.53,53.8 65.53,52.48 U1.15
  Bottom 0.254: v83.97,66.09 86.92,69.04 87.12,69.04 88.34,70.26 DRIVER1.7
IN1_3  (via drill 0.51)
  Top 0.254: v86.46,5.99 84.12,8.33 84.12,25.81 82.7,27.23 v82.7,48.26
  Bottom 0.254: v86.46,5.99 97.13,5.99 97.13,62.99 94.89,65.23 94.69,65.23 93.47,66.45 DRIVER1.10 | v82.7,48.26 81.99,48.97 71.53,48.97 68.07,52.43 U1.16
IN1_4  (via drill 0.51)
  Top 0.254: v87.53,55.73 91.14,59.33 91.14,63.91 93.42,63.91 DRIVER1.12
  Bottom 0.254: v87.53,55.73 73.86,55.73 70.61,52.48 U1.17
IN2_1  (via drill 0.51)
  Top 0.254: v17.78,64.01 19.91,61.87 v19.91,55.27
  Bottom 0.254: v17.78,64.01 15.8,64.01 14.63,65.18 DRIVER2.5 | v19.91,55.27 21.39,53.8 38.76,53.8 40.08,52.48 U1.7
IN2_2  (via drill 0.51)
  Top 0.254: v33.68,61.01 36.02,58.67 36.02,52.48 U1.8
  Bottom 0.254: v33.68,61.01 27.28,67.41 14.94,67.41 14.63,67.72 DRIVER2.7
IN2_3  (via drill 0.51)
  Top 0.254: v11.84,55.27 11.84,71.53 9.55,71.53 DRIVER2.10
  Bottom 0.254: v11.84,55.27 16.51,50.6 31.65,50.6 33.48,52.43 U1.9
IN2_4  (via drill 0.51)
  Top 0.254: v15.95,52.88 12.34,56.49 12.34,74.07 9.55,74.07 DRIVER2.12
  Bottom 0.254: v15.95,52.88 17.73,51.1 29.62,51.1 30.94,52.43 U1.10
PWM1  (via drill 0.51)
  Top 0.254: v92.61,55.83 96.22,59.44 96.22,62.99 96.16,63.04 96.16,71.53 93.47,71.53 DRIVER1.6 | v77.42,54.81 75.64,54.81 75.18,54.36 v63.91,54.36
  Bottom 0.254: v92.61,55.83 91.59,54.81 v77.42,54.81 | v63.91,54.36 63.35,53.8 62.43,53.8 58.83,50.19 53.85,50.19 52.83,51.21 52.83,52.43 U1.2
PWM2  (via drill 0.51)
  Top 0.254: v61.92,64.11 50.29,52.48 U1.3
  Bottom 0.254: v61.92,64.11 62.99,65.18 88.34,65.18 DRIVER1.11
PWM3
  Bottom 0.254: DRIVER2.6 9.5,66.45 8.33,65.28 8.08,65.28 7.26,64.47 7.26,57.2 40.44,57.2 45.16,52.48 U1.5
PWM4  (via drill 0.51)
  Top 0.254: v43.28,58.22 43.28,53.09 42.67,52.48 U1.6
  Bottom 0.254: v43.28,58.22 36.98,64.52 36.07,64.52 29.01,71.58 15.85,71.58 14.63,72.8 DRIVER2.11
SENSE1  (via drill 0.51)
  Top 0.254: v66.85,77.88 62.03,73.05 SENSE1.P$1
  Bottom 0.254: v66.85,77.88 88.34,77.88 DRIVER1.1
SENSE2  (via drill 0.51)
  Top 0.254: v63.6,64.26 63.6,65.38 62.03,66.95 R2.P$1
  Bottom 0.254: v63.6,64.26 63.75,64.11 75.03,64.11 78.99,60.15 88.34,60.15 DRIVER1.15
SENSE3  (via drill 0.51)
  Top 0.254: v35.76,60.76 41.96,66.95 SENSE2.P$1
  Bottom 0.254: v35.76,60.76 35.1,60.1 14.63,60.1 DRIVER2.1
SENSE4  (via drill 0.51)
  Top 0.254: v37.13,77.88 41.96,73.05 R1.P$1
  Bottom 0.254: v37.13,77.88 14.63,77.88 DRIVER2.15
V+MTR1  (via drill 0.51)
  Top 0.305: v67.46,63.14 69.24,64.92 U$14.A 69.39,65.02 69.39,67.97 U$13.C 69.44,68.12 69.44,68.83 v70.76,70.16 | v51.77,63.14 49.78,63.14 49.78,63.7 MTRCONN.P8 | v81.53,74.37 85.24,78.08 85.24,79.3 90.78,79.3 93.42,76.66 DRIVER1.2
  Bottom 0.305: v51.77,63.14 v67.46,63.14 | v81.53,74.37 77.32,70.16 v70.76,70.16
V+MTR2  (via drill 0.51)
  Top 0.305: 76.4,66.7 76.4,67.97 U$9.C | 76.4,66.7 76.4,65.02 U$10.A 76.45,64.87 77.11,64.21 v77.11,63.6 | v60.4,66.7 49.78,66.7 MTRCONN.P6 | 76.4,66.7 v75.44,66.7
  Bottom 0.305: v77.11,63.6 78.08,62.64 88.34,62.64 DRIVER1.13 | v75.44,66.7 v60.4,66.7
V+MTR3  (via drill 0.51)
  Top 0.305: v32.72,69.29 31.5,68.07 U$7.C 31.39,67.97 31.39,65.02 U$8.A 31.55,64.97 v32.61,63.91 | v47.7,69.29 49.73,69.29 49.73,69.75 MTRCONN.P4
  Bottom 0.305: v47.7,69.29 v32.72,69.29 | v32.61,63.91 36.73,63.91 36.73,60.35 35.1,58.73 12.19,58.73 9.55,61.37 DRIVER2.2
V+MTR4  (via drill 0.51)
  Top 0.305: U$4.A 23.42,65.02 23.42,67.97 U$3.C 23.27,68.07 16,75.34 14.63,75.34 DRIVER2.13 | v43.59,72.8 49.73,72.8 MTRCONN.P2
  Bottom 0.305: v43.59,72.8 41.05,75.34 14.63,75.34 DRIVER2.13
V-MTR1  (via drill 0.51)
  Top 0.305: U$12.A 69.39,71.02 69.39,73.97 U$11.C 69.55,73.97 v71.22,73.97 | v47.8,67.51 47.8,65.28 49.73,65.28 MTRCONN.P7
  Bottom 0.305: DRIVER1.3 88.34,75.34 72.59,75.34 v71.22,73.97 71.12,73.86 54.15,73.86 v47.8,67.51
V-MTR2  (via drill 0.51)
  Top 0.305: 76.4,72.08 76.4,73.97 FLYBACK1.C | 76.4,72.08 76.4,71.02 U$1.A 76.4,70.87 78.08,69.19 v78.08,59.69 | v60.5,68.63 60.5,68.28 49.78,68.28 MTRCONN.P5 | 76.4,72.08 v75.23,72.08
  Bottom 0.305: v78.08,59.69 79.05,58.73 90.78,58.73 93.42,61.37 DRIVER1.14 | v60.5,68.63 63.96,72.08 v75.23,72.08
V-MTR3  (via drill 0.51)
  Top 0.305: U$6.A 31.39,71.02 31.39,73.97 U$5.C | v26.87,66.45 31.29,70.87 U$6.A | v36.52,71.27 49.73,71.27 MTRCONN.P3 | v32.66,71.27 31.5,71.27 U$6.A
  Bottom 0.305: v26.87,66.45 23.11,62.69 14.63,62.69 DRIVER2.3 | v32.66,71.27 v36.52,71.27
V-MTR4
  Top 0.305: U$2.A 23.42,71.02 23.42,73.97 FLYBACK2.C | FLYBACK2.C 23.27,74.07 18.03,79.3 9.55,79.3 9.55,76.66 DRIVER2.14 | MTRCONN.P1 49.73,74.27 45.16,78.84 23.47,78.84 23.47,74.12 FLYBACK2.C

### Text on the board
tDocu: MTRV+ | GND | 7-12V | GND | NanoLab | Water Runner V1